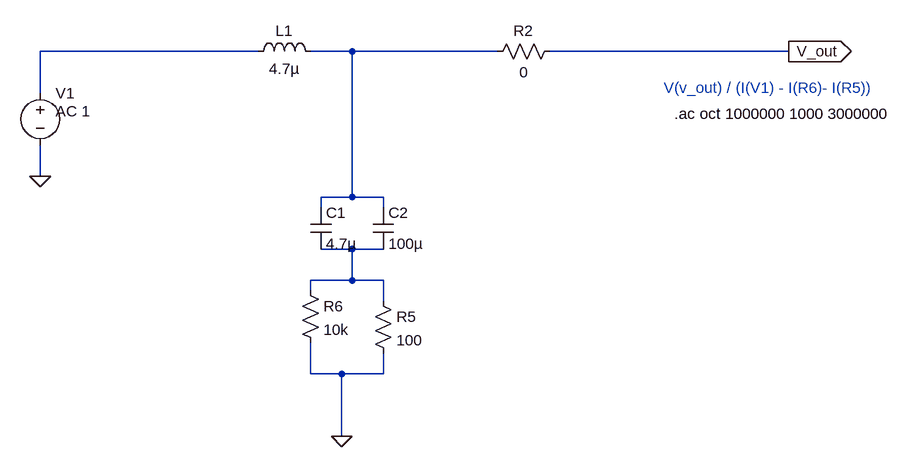
[diagram p0: schematic Draft1.asc]
Draft1.asc, the LTspice schematic file:
Version 4
SHEET 1 1324 868
WIRE 240 144 -96 144
WIRE 384 144 320 144
WIRE 608 144 384 144
WIRE 1056 144 688 144
WIRE -96 208 -96 144
WIRE -96 336 -96 288
WIRE 384 368 384 144
WIRE 384 368 336 368
WIRE 432 368 384 368
WIRE 336 384 336 368
WIRE 432 384 432 368
WIRE 384 448 336 448
WIRE 432 448 384 448
WIRE 384 496 384 448
WIRE 384 496 320 496
WIRE 432 496 384 496
WIRE 320 512 320 496
WIRE 432 528 432 496
WIRE 320 640 320 592
WIRE 368 640 320 640
WIRE 432 640 432 608
WIRE 432 640 368 640
WIRE 368 736 368 640
FLAG -96 336 0
FLAG 1056 144 V_out
IOPIN 1056 144 Out
FLAG 368 736 0
SYMBOL ind 224 160 R270
WINDOW 0 32 56 VTop 2
WINDOW 3 5 56 VBottom 2
SYMATTR InstName L1
SYMATTR Value 4.7µ
SYMBOL voltage -96 192 R0
WINDOW 123 24 44 Left 2
WINDOW 39 0 0 Left 0
WINDOW 3 24 72 Left 2
SYMATTR Value2 AC 1
SYMATTR Value ""
SYMATTR InstName V1
SYMBOL res 416 512 R0
SYMATTR InstName R5
SYMATTR Value 100
SYMBOL res 304 496 R0
SYMATTR InstName R6
SYMATTR Value 10k
SYMBOL res 704 128 R90
WINDOW 0 0 56 VBottom 2
WINDOW 3 32 56 VTop 2
SYMATTR InstName R2
SYMATTR Value 0
SYMBOL cap 320 384 R0
SYMATTR InstName C1
SYMATTR Value 4.7µ
SYMBOL cap 416 384 R0
SYMATTR InstName C2
SYMATTR Value 100µ
TEXT 880 240 Left 2 !.ac oct 1000000 1000 3000000
TEXT 864 200 Left 2 ;V(v_out) / (I(V1) - I(R6)- I(R5))

The netlist it stands for:
* Draft1.asc
L1 N001 N002 4.7µ
V1 N001 0 AC 1
R5 N003 0 100
R6 N003 0 10k
R2 V_out N002 0
C1 N002 N003 4.7µ
C2 N002 N003 100µ
.ac oct 1000000 1000 3000000
* V(v_out) / (I(V1) - I(R6)- I(R5))
.backanno
.end